# EAGLE schematic AccelAdapter (EAGLE 6.4)
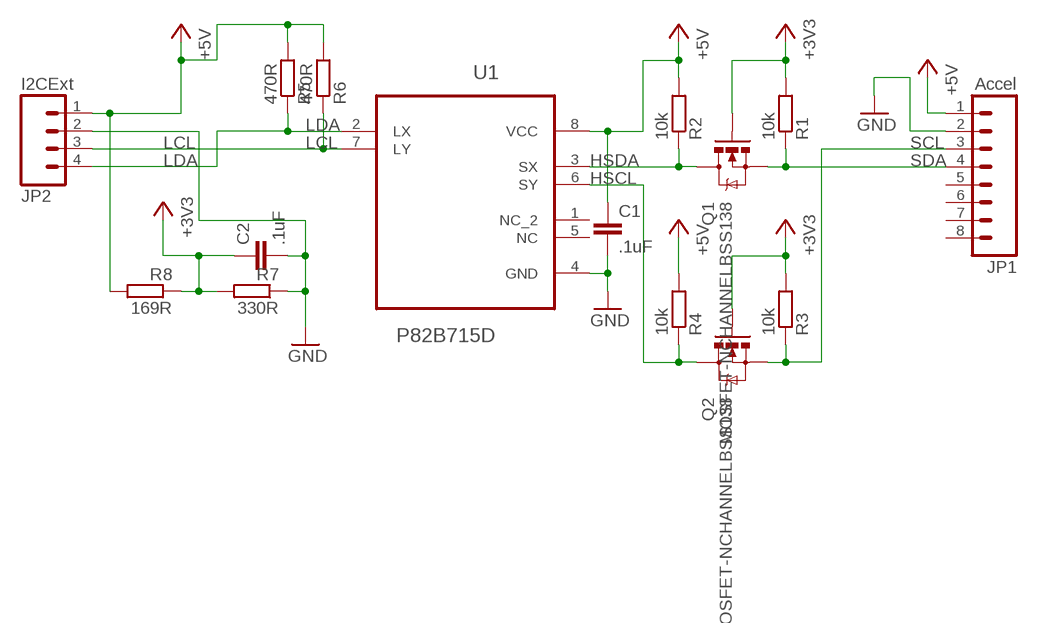
[diagram p0: schematic, sheet 1]

## Parts
C1  .1uF  C-EUC0805  [C0805]
C2  .1uF  C-EUC0805  [C0805]
JP1  Accel  M081X08  [1X08]
JP2  I2CExt  M04PTH  [1X04]
Q1  MOSFET-NCHANNELBSS138  [SOT23]
Q2  MOSFET-NCHANNELBSS138  [SOT23]
R1  10k  R-EU_R0805  [R0805]
R2  10k  R-EU_R0805  [R0805]
R3  10k  R-EU_R0805  [R0805]
R4  10k  R-EU_R0805  [R0805]
R5  470R  R-EU_R0805  [R0805]
R6  470R  R-EU_R0805  [R0805]
R7  330R  R-EU_R0805  [R0805]
R8  169R  R-EU_R0805  [R0805]
U1  P82B715D  [SOIC127P600X175-8N]

## Nets
+3V3: C2.1 Q1.1(G) Q2.1(G) R1.2 R3.2 R7.2 R8.1
+5V: C1.1 JP1.1 JP2.1 R2.2 R4.2 R5.2 R6.2 R8.2 U1.8(VCC)
GND: C1.2 C2.2 JP1.2 JP2.2 R7.1 U1.4(GND)
HSCL: Q2.3(D) R4.1 U1.6(SY)
HSDA: Q1.3(D) R2.1 U1.3(SX)
LCL: JP2.3 R6.1 U1.7(LY)
LDA: JP2.4 R5.1 U1.2(LX)
SCL: JP1.3 Q2.2(S) R3.1
SDA: JP1.4 Q1.2(S) R1.1
Unconnected: JP1.5 JP1.6 JP1.7 JP1.8 U1.1(NC_2) U1.5(NC)

## Library data of the parts
C1 C2 = rcl:C-EU: CAPACITOR, European symbol; MPN: MCCA000386; OC_NEWARK: 33R0609
JP1 = SparkFun-Connectors:M08: Header 8 Standard 8-pin 0.1" header. Use with straight break away headers (SKU : PRT-00116), right angle break away headers (PRT-00553), swiss pins (PRT-00743), machine pins (PRT-00117), and female headers (PRT-00115).; OC_NEWARK: unknown
JP2 = SparkFun-Connectors:M04: Header 4 Standard 4-pin 0.1" header. Use with straight break away headers (SKU : PRT-00116), right angle break away headers (PRT-00553), swiss pins (PRT-00743), machine pins (PRT-00117), and female headers (PRT-00115). Molex polarized connector foot print use with SKU : PRT-08231 with associated crimp pins and housings. 1MM SMD Version SKU: PRT-10208; OC_NEWARK: unknown
Q1 Q2 = SparkFun-DiscreteSemi:MOSFET-NCHANNEL: Common NMOSFET Parts MFG P/N Store ID Prod ID FDD8780 TRANS-09984 SI7820DN TRANS-11055 FDS6630A IC-08089 2N7002PW TRANS-11151 FQP30N06L COM-10213 TRANS-10060 BSS123LT1G TRANS-08345 BSS138 TRANS-00830 BS170 2N7000; OC_NEWARK: unknown; PROD_ID: TRANS-00830
R1-R4 = rcl:R-EU_: RESISTOR, European symbol; MPN: RC0805JR-1310KL; OC_NEWARK: 68R0287
R5-R8 = rcl:R-EU_: RESISTOR, European symbol; MPN: RC0805JR-07470RL; OC_NEWARK: 66R3683
U1 = Texas Instruments_By_element14_Batch_1:P82B715D: I2C BUS EXTENDER; MPN: P82B715D; OC_FARNELL: 1604945; OC_NEWARK: 84M9793; PACKAGE: SOIC-8; SUPPLIER: Texas Instruments

## Net classes
0 default: clearance 0.355 mm